# Altium schematic sheet Armor_Plate_V2.1.SchDoc
size A2
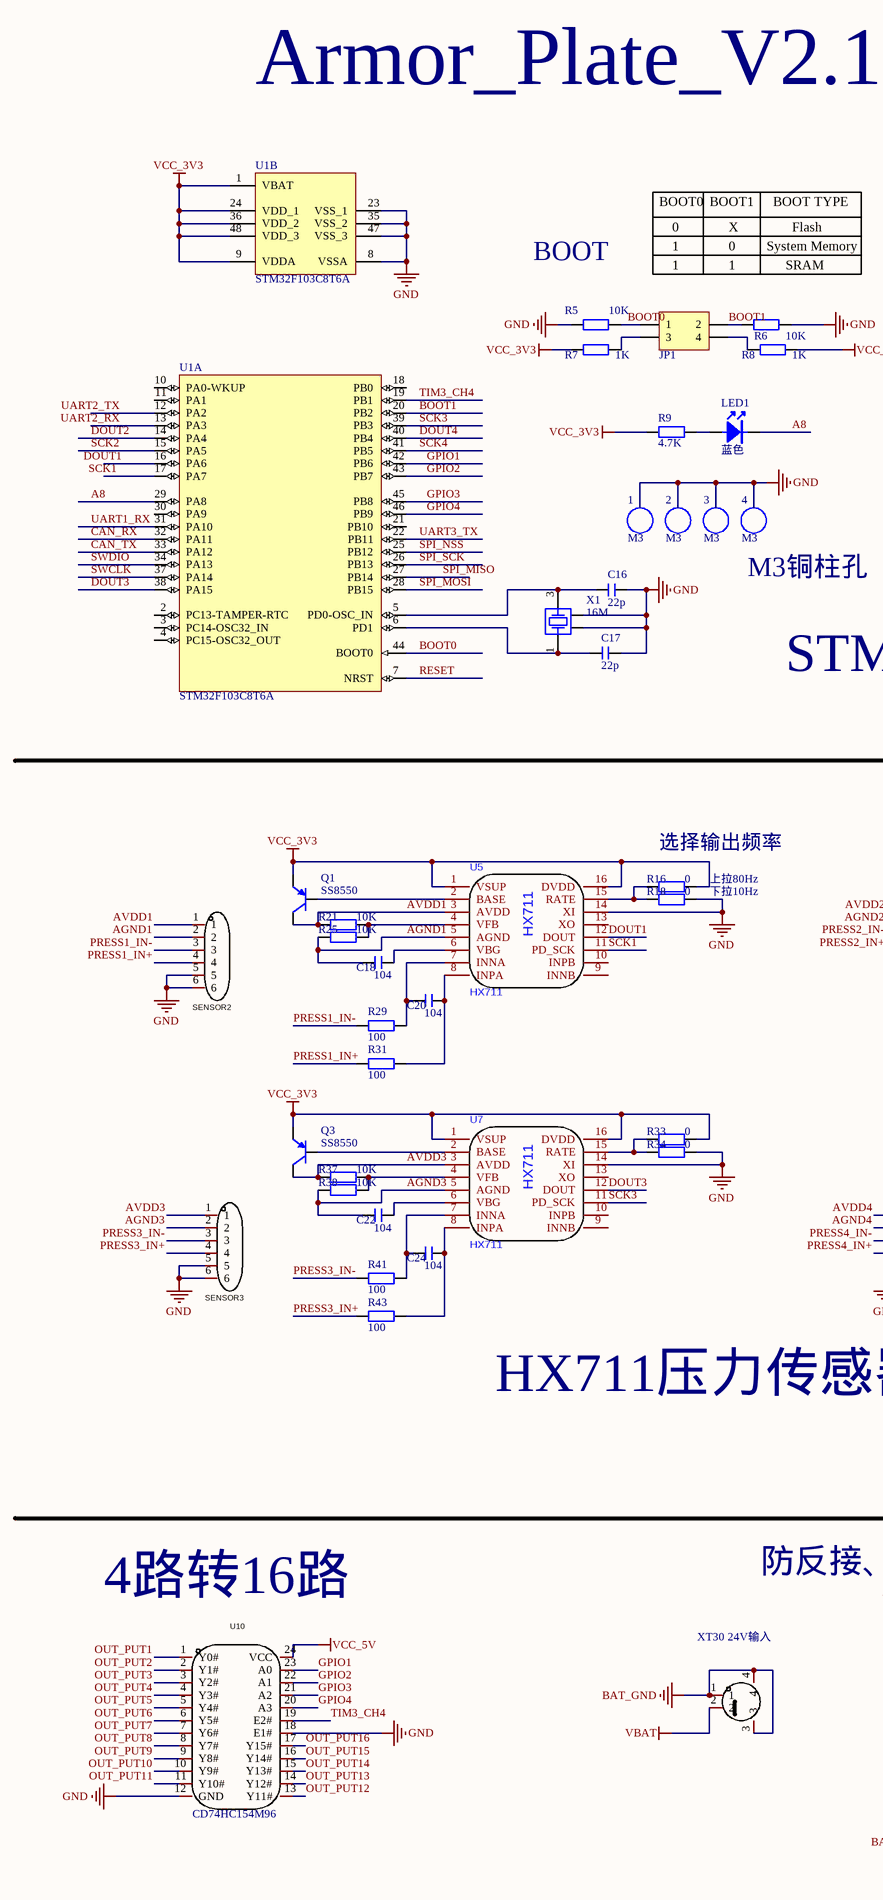
[diagram p0: Armor_Plate_V2.1.SchDoc, left]
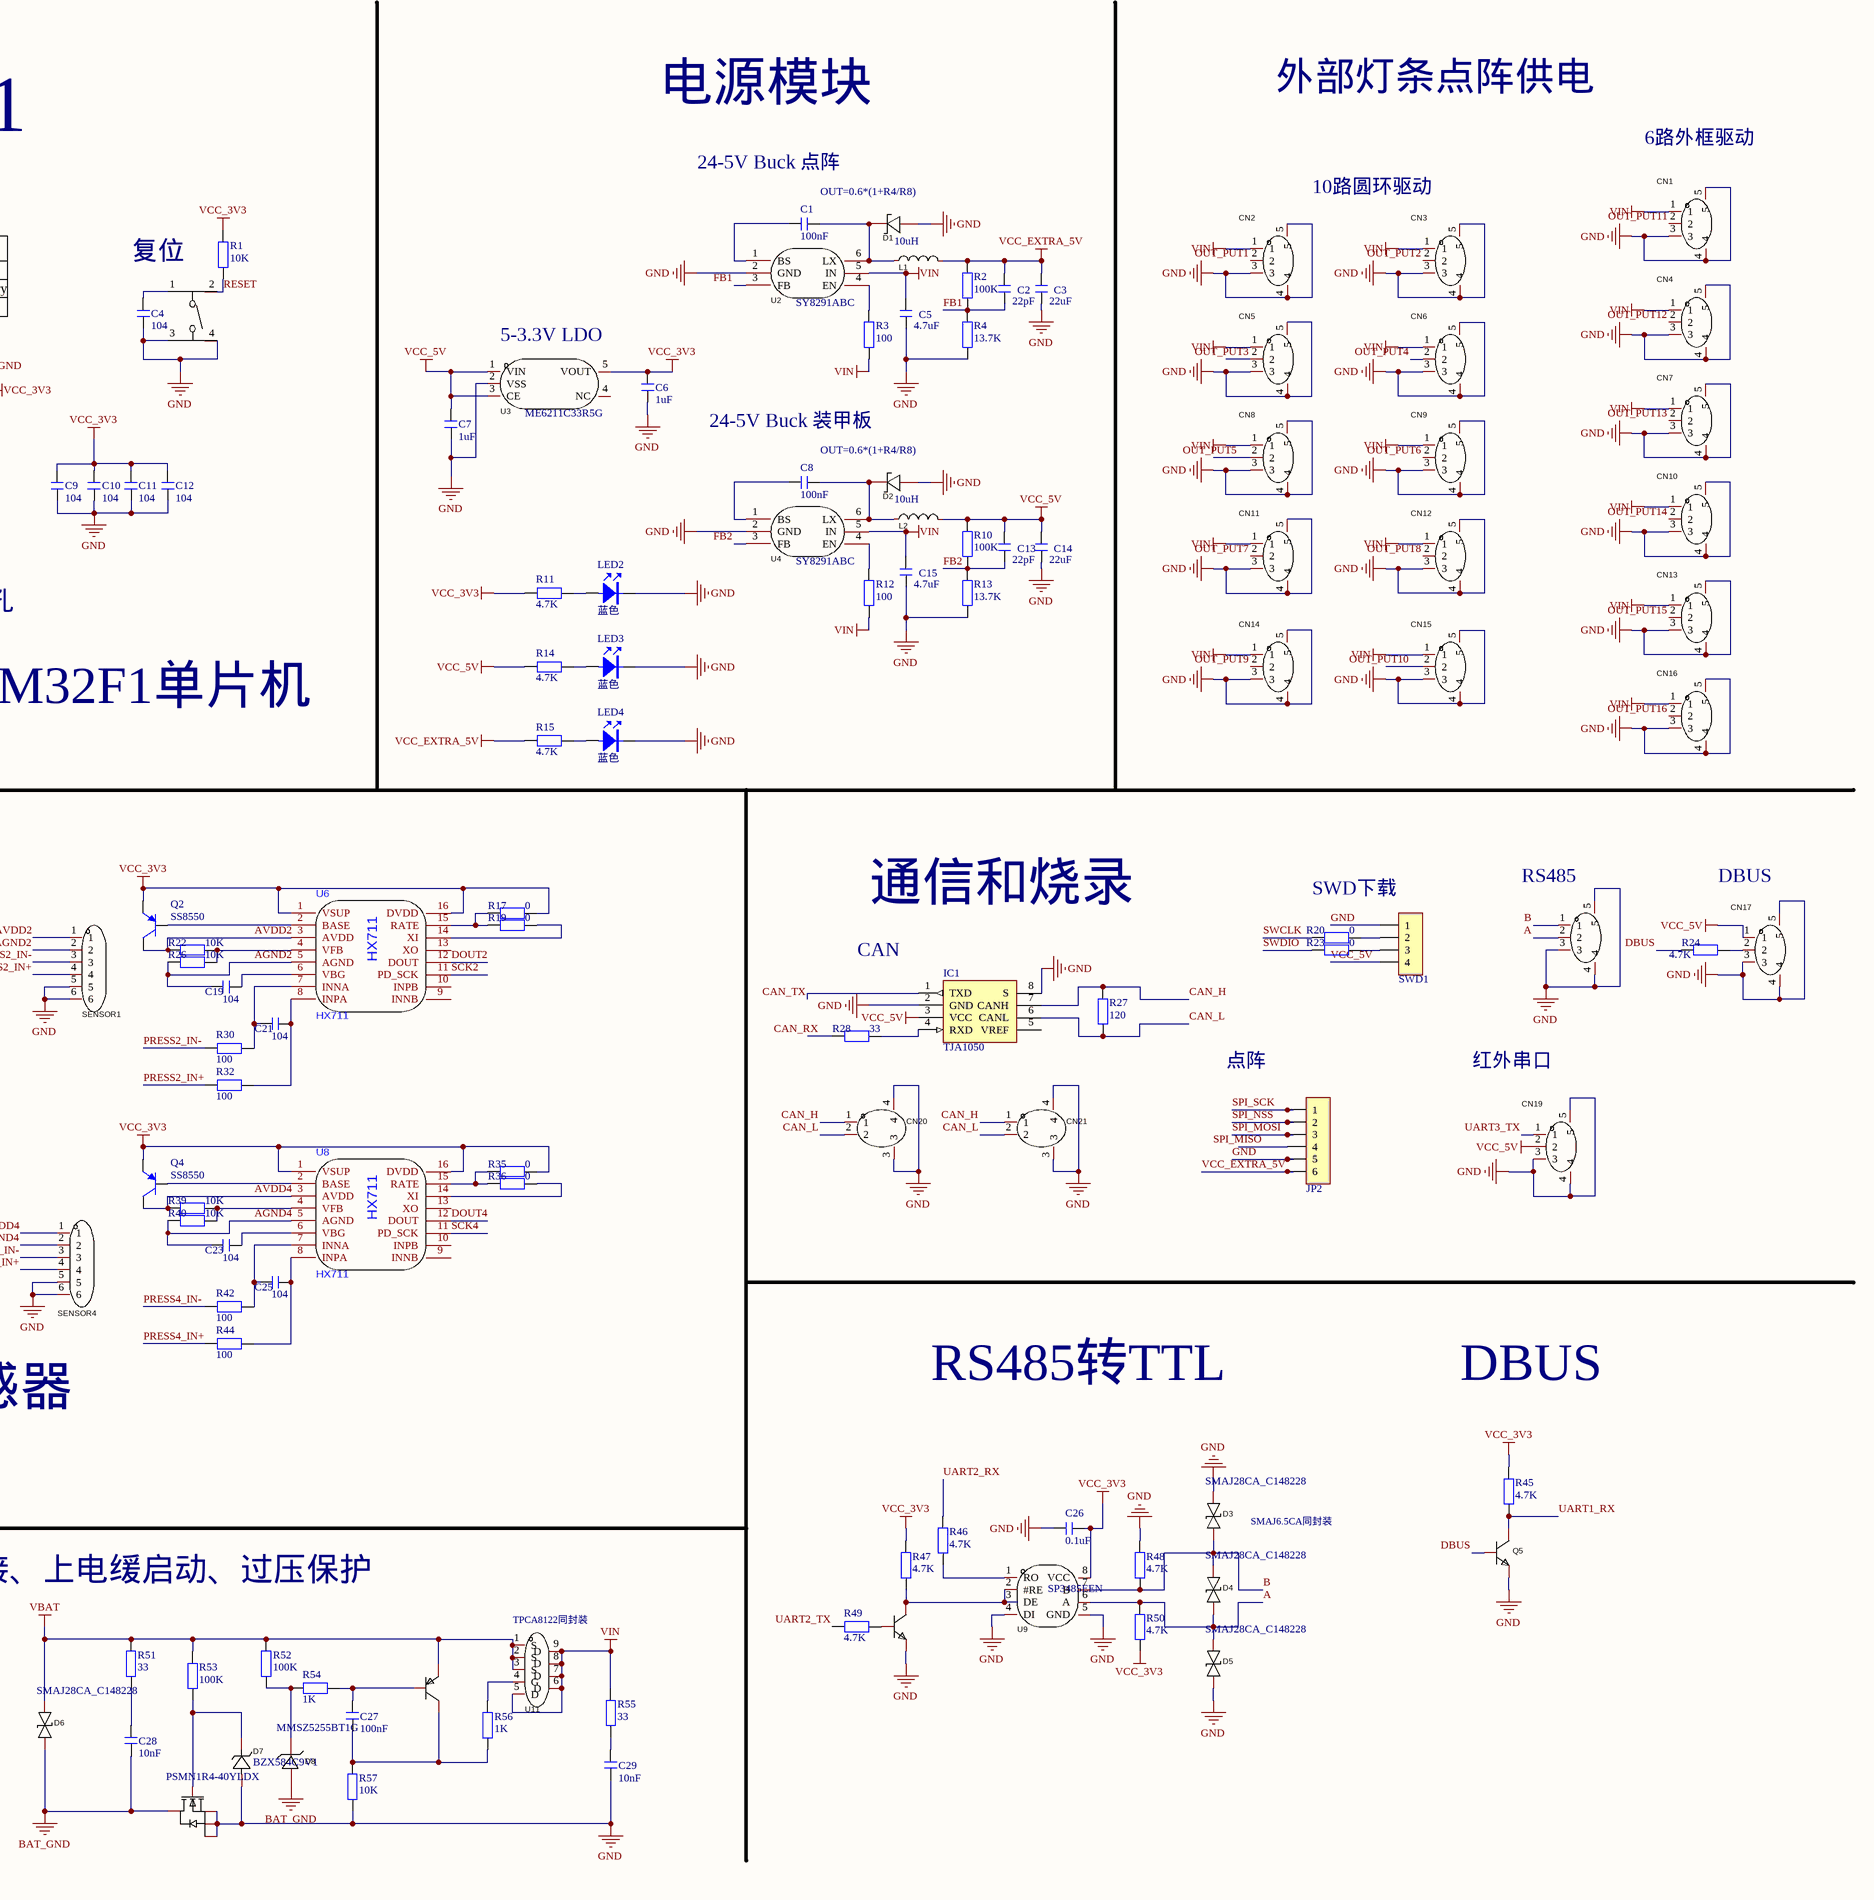
[diagram p1: Armor_Plate_V2.1.SchDoc, right]

## Parts
1  M3  [M3 125X200]
2  M3  [M3 125X200]
3  M3  [M3 125X200]
4  M3  [M3 125X200]
C1  100nF  [C 0603_L]
C2  22pF  [C 0603_L]
C3  22uF  [C 0603_L]
C4  104  [C 0603_L]
C5  4.7uF  [C 0603_L]
C6  1uF  [C 0603_L]
C7  1uF  [C 0603_L]
C8  100nF  [C 0603_L]
C9  104  [C 0603_L]
C10  104  [C 0603_L]
C11  104  [C 0603_L]
C12  104  [C 0603_L]
C13  22pF  [C 0603_L]
C14  22uF  [C 0603_L]
C15  4.7uF  [C 0603_L]
C16  22p  [C 0603_L]
C17  22p  [C 0603_L]
C18  104  [C 0603_L]
C19  104  [C 0603_L]
C20  104  [C 0603_L]
C21  104  [C 0603_L]
C22  104  [C 0603_L]
C23  104  [C 0603_L]
C24  104  [C 0603_L]
C25  104  [C 0603_L]
C26  0.1uF  [C 0603_L]
C27  100nF  [C 0603_L]
C28  10nF  [C 0603_L]
C29  10nF  [C 0603_L]
CN1  HX25003-3AWB  [CONN-SMD_3P-P2.50_HX25003-3AWB]  (value not drawn)
CN2  HX25003-3AWB  [CONN-SMD_3P-P2.50_HX25003-3AWB]  (value not drawn)
CN3  HX25003-3AWB  [CONN-SMD_3P-P2.50_HX25003-3AWB]  (value not drawn)
CN4  HX25003-3AWB  [CONN-SMD_3P-P2.50_HX25003-3AWB]  (value not drawn)
CN5  HX25003-3AWB  [CONN-SMD_3P-P2.50_HX25003-3AWB]  (value not drawn)
CN6  HX25003-3AWB  [CONN-SMD_3P-P2.50_HX25003-3AWB]  (value not drawn)
CN7  HX25003-3AWB  [CONN-SMD_3P-P2.50_HX25003-3AWB]  (value not drawn)
CN8  HX25003-3AWB  [CONN-SMD_3P-P2.50_HX25003-3AWB]  (value not drawn)
CN9  HX25003-3AWB  [CONN-SMD_3P-P2.50_HX25003-3AWB]  (value not drawn)
CN10  HX25003-3AWB  [CONN-SMD_3P-P2.50_HX25003-3AWB]  (value not drawn)
CN11  HX25003-3AWB  [CONN-SMD_3P-P2.50_HX25003-3AWB]  (value not drawn)
CN12  HX25003-3AWB  [CONN-SMD_3P-P2.50_HX25003-3AWB]  (value not drawn)
CN13  HX25003-3AWB  [CONN-SMD_3P-P2.50_HX25003-3AWB]  (value not drawn)
CN14  HX25003-3AWB  [CONN-SMD_3P-P2.50_HX25003-3AWB]  (value not drawn)
CN15  HX25003-3AWB  [CONN-SMD_3P-P2.50_HX25003-3AWB]  (value not drawn)
CN16  HX25003-3AWB  [CONN-SMD_3P-P2.50_HX25003-3AWB]  (value not drawn)
CN17  HX25003-3AWB  [CONN-SMD_3P-P2.50_HX25003-3AWB]  (value not drawn)
CN18  HX25003-3AWB  [CONN-SMD_3P-P2.50_HX25003-3AWB]  (value not drawn)
CN19  HX25003-3AWB  [CONN-SMD_3P-P2.50_HX25003-3AWB]  (value not drawn)
CN20  A1257WR-S-2P  [CONN-SMD_A1257WR-S-2P]  (value not drawn)
CN21  A1257WR-S-2P  [CONN-SMD_A1257WR-S-2P]  (value not drawn)
CN22  XT30PW-M  [CONN-TH_XT30PW-M]  (value not drawn)
D1  1N5819WS_C191023  [SOD-323_L1.8-W1.3-LS2.5-RD]  (value not drawn)
D2  1N5819WS_C191023  [SOD-323_L1.8-W1.3-LS2.5-RD]  (value not drawn)
D3  SMAJ28CA_C148228  [SMA_L4.4-W2.6-LS5.0-BI]
D4  SMAJ28CA_C148228  [SMA_L4.4-W2.6-LS5.0-BI]
D5  SMAJ28CA_C148228  [SMA_L4.4-W2.6-LS5.0-BI]
D6  SMAJ28CA_C148228  [SMA_L4.4-W2.6-LS5.0-BI]
D7  BZX584C9V1  [ESC_L1.2-W0.8-LS1.6-RD]
D8  MMSZ5255BT1G  [SOD-123_L2.7-W1.6-LS3.7-RD]
IC1  TJA1050  [SOP8_N]
JP1  Header2X2  [HDR2.54-LI-2x2P]  (value not drawn)
JP2  HDR-1X6  [MX 1.25-WS-6P]  (value not drawn)
L1  10uH  [IND-SMD_L11.2-W10.0]
L2  10uH  [IND-SMD_L11.2-W10.0]
LED1  蓝色  [LED 0805B]
LED2  蓝色  [LED 0805B]
LED3  蓝色  [LED 0805B]
LED4  蓝色  [LED 0805B]
Q1  SS8550  [SOT23-3N]
Q2  SS8550  [SOT23-3N]
Q3  SS8550  [SOT23-3N]
Q4  SS8550  [SOT23-3N]
Q5  S8050_C5249674  [SOT-23-3_L2.9-W1.6-P1.90-LS2.8-BR]  (value not drawn)
Q6  S8050_C5249674  [SOT-23-3_L2.9-W1.6-P1.90-LS2.8-BR]  (value not drawn)
Q7  S8550_C545533  [SOT-23-3_L2.9-W1.6-P1.90-LS2.8-BR]  (value not drawn)
Q8  PSMN1R4-40YLDX  [SOT-669_L4.9-W4.0-P1.27-LS6.0-BR]
R1  10K  [R 0603_L]
R2  100K  [R 0603_L]
R3  100  [R 0603_L]
R4  13.7K  [R 0603_L]
R5  10K  [R 0603_L]
R6  10K  [R 0603_L]
R7  1K  [R 0603_L]
R8  1K  [R 0603_L]
R9  4.7K  [R 0603_L]
R10  100K  [R 0603_L]
R11  4.7K  [R 0603_L]
R12  100  [R 0603_L]
R13  13.7K  [R 0603_L]
R14  4.7K  [R 0603_L]
R15  4.7K  [R 0603_L]
R16  0  [R 0603_L]
R17  0  [R 0603_L]
R18  0  [R 0603_L]
R19  0  [R 0603_L]
R20  0  [R 0603_L]
R21  10K  [R 0603_L]
R22  10K  [R 0603_L]
R23  0  [R 0603_L]
R24  4.7K  [R 0603_L]
R25  10K  [R 0603_L]
R26  10K  [R 0603_L]
R27  120  [R 0603_L]
R28  33  [R 0603_L]
R29  100  [R 0603_L]
R30  100  [R 0603_L]
R31  100  [R 0603_L]
R32  100  [R 0603_L]
R33  0  [R 0603_L]
R34  0  [R 0603_L]
R35  0  [R 0603_L]
R36  0  [R 0603_L]
R37  10K  [R 0603_L]
R38  10K  [R 0603_L]
R39  10K  [R 0603_L]
R40  10K  [R 0603_L]
R41  100  [R 0603_L]
R42  100  [R 0603_L]
R43  100  [R 0603_L]
R44  100  [R 0603_L]
R45  4.7K  [R 0603_L]
R46  4.7K  [R 0603_L]
R47  4.7K  [R 0603_L]
R48  4.7K  [R 0603_L]
R49  4.7K  [R 0603_L]
R50  4.7K  [R 0603_L]
R51  33  [R 0603_L]
R52  100K  [R 0603_L]
R53  100K  [R 0603_L]
R54  1K  [R 0603_L]
R55  33  [R 0603_L]
R56  1K  [R 0603_L]
R57  10K  [R 0603_L]
SENSOR1  GH125-S04DCA-00  [CONN-SMD_4P-P1.27_GH125-S04DCA-00]  (value not drawn)
SENSOR2  GH125-S04DCA-00  [CONN-SMD_4P-P1.27_GH125-S04DCA-00]  (value not drawn)
SENSOR3  GH125-S04DCA-00  [CONN-SMD_4P-P1.27_GH125-S04DCA-00]  (value not drawn)
SENSOR4  GH125-S04DCA-00  [CONN-SMD_4P-P1.27_GH125-S04DCA-00]  (value not drawn)
SW1  ST-1188  [SW-SMD_4P-L4.2-W3.2-P2.15-LS5.2]  (value not drawn)
SWD1  HDR-1X4  [MX 1.25-WS-4P]  (value not drawn)
U1  STM32F103C8T6A  [LQFP48 7X7_N]  (parts A,B of 2)
U2  SY8291ABC  [SOT-23-6_L2.9-W1.6-P0.95-LS2.8-BR]
U3  ME6211C33R5G  [SOT-23-5_L3.0-W1.7-P0.95-LS2.8-BR]
U4  SY8291ABC  [SOT-23-6_L2.9-W1.6-P0.95-LS2.8-BR]
U5  HX711  [SOP-16_L10.0-W3.9-P1.27-LS6.0-BL]
U6  HX711  [SOP-16_L10.0-W3.9-P1.27-LS6.0-BL]
U7  HX711  [SOP-16_L10.0-W3.9-P1.27-LS6.0-BL]
U8  HX711  [SOP-16_L10.0-W3.9-P1.27-LS6.0-BL]
U9  SP3485EEN  [SOP-8_L5.0-W4.0-P1.27-LS6.0-BL]
U10  CD74HC154M96  [SOIC-24_L15.4-W7.5-P1.27-LS10.3-BL]
U11  TPCA8122  [DFN-8_L5.8-W4.9-P1.27-LS6.0-BL-1]  (value not drawn)
X1  16M  [OSC 3225-4P]

## Nets
BAT_GND: C28.2 CN22.1 CN22.3 CN22.4 D6.1 D8.2(A) Q8.5(D)
GND: C3.1 C4.1 C5.1 C6.1 C7.1 C9.1 C10.1 C11.1 C12.1 C14.1 C15.1 C16.2 C17.2 C26.1 C29.2 CN1.3 CN1.4 CN1.5 CN2.3 CN2.4 CN2.5 CN3.3 CN3.4 CN3.5 CN4.3 CN4.4 CN4.5 CN5.3 CN5.4 CN5.5 CN6.3 CN6.4 CN6.5 CN7.3 CN7.4 CN7.5 CN8.3 CN8.4 CN8.5 CN9.3 CN9.4 CN9.5 CN10.3 CN10.4 CN10.5 CN11.3 CN11.4 CN11.5 CN12.3 CN12.4 CN12.5 CN13.3 CN13.4 CN13.5 CN14.3 CN14.4 CN14.5 CN15.3 CN15.4 CN15.5 CN16.3 CN16.4 CN16.5 CN17.3 CN17.4 CN17.5 CN18.3 CN18.4 CN18.5 CN19.3 CN19.4 CN19.5 CN20.3 CN20.4 CN21.3 CN21.4 D1.2(A) D2.2(A) D3.2 D5.1 D7.2(A) IC1.2(GND) IC1.8(S) JP2.5 LED2.2(K) LED3.2(K) LED4.2(K) Q5.2(E) Q6.2(E) Q8.1(S) Q8.2(S) Q8.3(S) R4.1 R5.1 R6.2 R13.1 R18.2 R34.2 R48.2 R57.2 SENSOR1.5 SENSOR1.6 SENSOR2.5 SENSOR2.6 SENSOR3.5 SENSOR3.6 SENSOR4.5 SENSOR4.6 SW1.3 SW1.4 SWD1.1 U1.8(VSSA) U1.23(VSS_1) U1.35(VSS_2) U1.47(VSS_3) U2.2(GND) U3.2(VSS) U4.2(GND) U5.14(XI) U7.14(XI) U9.4(DI) U9.5(GND) U10.12(GND) U10.18(E1#) X1.2 X1.4
VBAT: CN22.2 D6.2 Q7.2(E) R51.2 R52.2 R53.2 U11.1(S) U11.2(S) U11.3(S)
VCC_3V3: C6.2 C9.2 C10.2 C11.2 C12.2 C26.2 Q1.2(E) Q2.2(E) Q3.2(E) Q4.2(E) R1.2 R7.1 R8.2 R9.1 R11.1 R16.2 R17.2 R33.2 R35.2 R45.2 R47.2 R50.1 U1.1(VBAT) U1.9(VDDA) U1.24(VDD_1) U1.36(VDD_2) U1.48(VDD_3) U3.5(VOUT) U5.1(VSUP) U5.16(DVDD) U6.1(VSUP) U6.16(DVDD) U7.1(VSUP) U7.16(DVDD) U8.1(VSUP) U8.16(DVDD) U9.8(VCC)
VCC_5V: C7.2 C13.2 C14.2 CN17.1 CN19.2 IC1.3(VCC) L2.2 R10.2 R14.1 SWD1.4 U3.1(VIN) U3.3(CE) U10.24(VCC)
VCC_EXTRA_5V: C2.2 C3.2 JP2.6 L1.2 R2.2 R15.1
VIN: C5.2 C15.2 CN1.1 CN2.1 CN3.1 CN4.1 CN5.1 CN6.1 CN7.1 CN8.1 CN9.1 CN10.1 CN11.1 CN12.1 CN13.1 CN14.1 CN15.1 CN16.1 R3.1 R12.1 R55.1 U2.5(IN) U4.5(IN) U11.5(D) U11.6(D) U11.7(D) U11.8(D) U11.9(D)
A: CN18.2 D4.1 D5.2 R50.2 U9.6(A)
A8: LED1.2(K) U1.29(PA8)
AGND1: C18.2 R25.1 SENSOR2.2 U5.5(AGND)
AGND2: C19.2 R26.1 SENSOR1.2 U6.5(AGND)
AGND3: C22.2 R38.1 SENSOR3.2 U7.5(AGND)
AGND4: C23.2 R40.1 SENSOR4.2 U8.5(AGND)
AVDD1: Q1.3(C) R21.1 SENSOR2.1 U5.3(AVDD)
AVDD2: Q2.3(C) R22.1 SENSOR1.1 U6.3(AVDD)
AVDD3: Q3.3(C) R37.1 SENSOR3.1 U7.3(AVDD)
AVDD4: Q4.3(C) R39.1 SENSOR4.1 U8.3(AVDD)
B: CN18.1 D3.1 D4.2 R48.1 U9.7(B)
BOOT0: JP1.1 R5.2 U1.44(BOOT0)
BOOT1: JP1.2 R6.1 U1.20(PB2)
CAN_H: CN20.1 CN21.1 IC1.7(CANH) R27.2
CAN_L: CN20.2 CN21.2 IC1.6(CANL) R27.1
CAN_RX: R28.1 U1.32(PA11)
CAN_TX: IC1.1(TXD) U1.33(PA12)
DBUS: Q5.1(B) R24.1
DOUT1: U1.16(PA6) U5.12(DOUT)
DOUT2: U1.14(PA4) U6.12(DOUT)
DOUT3: U1.38(PA15) U7.12(DOUT)
DOUT4: U1.40(PB4) U8.12(DOUT)
FB1: C2.1 R2.1 R4.2 U2.3(FB)
FB2: C13.1 R10.1 R13.2 U4.3(FB)
GPIO1: U1.42(PB6) U10.23(A0)
GPIO2: U1.43(PB7) U10.22(A1)
GPIO3: U1.45(PB8) U10.21(A2)
GPIO4: U1.46(PB9) U10.20(A3)
OUT_PUT1: CN2.2 U10.1(Y0#)
OUT_PUT2: CN3.2 U10.2(Y1#)
OUT_PUT3: CN5.2 U10.3(Y2#)
OUT_PUT4: CN6.2 U10.4(Y3#)
OUT_PUT5: CN8.2 U10.5(Y4#)
OUT_PUT6: CN9.2 U10.6(Y5#)
OUT_PUT7: CN11.2 U10.7(Y6#)
OUT_PUT8: CN12.2 U10.8(Y7#)
OUT_PUT9: CN14.2 U10.9(Y8#)
OUT_PUT10: CN15.2 U10.10(Y9#)
OUT_PUT11: CN1.2 U10.11(Y10#)
OUT_PUT12: CN4.2 U10.13(Y11#)
OUT_PUT13: CN7.2 U10.14(Y12#)
OUT_PUT14: CN10.2 U10.15(Y13#)
OUT_PUT15: CN13.2 U10.16(Y14#)
OUT_PUT16: CN16.2 U10.17(Y15#)
PRESS1_IN+: R31.2 SENSOR2.4
PRESS1_IN-: R29.1 SENSOR2.3
PRESS2_IN+: R32.2 SENSOR1.4
PRESS2_IN-: R30.1 SENSOR1.3
PRESS3_IN+: R43.2 SENSOR3.4
PRESS3_IN-: R41.1 SENSOR3.3
PRESS4_IN+: R44.2 SENSOR4.4
PRESS4_IN-: R42.1 SENSOR4.3
RESET: R1.1 SW1.2 U1.7(NRST)
SCK1: U1.17(PA7) U5.11(PD_SCK)
SCK2: U1.15(PA5) U6.11(PD_SCK)
SCK3: U1.39(PB3) U7.11(PD_SCK)
SCK4: U1.41(PB5) U8.11(PD_SCK)
SPI_MISO: JP2.4 U1.27(PB14)
SPI_MOSI: JP2.3 U1.28(PB15)
SPI_NSS: JP2.2 U1.25(PB12)
SPI_SCK: JP2.1 U1.26(PB13)
SWCLK: R20.1 U1.37(PA14)
SWDIO: R23.1 U1.34(PA13)
TIM3_CH4: U1.19(PB1) U10.19(E2#)
UART1_RX: Q5.3(C) R45.1 U1.31(PA10)
UART2_RX: R46.2 U1.13(PA3)
UART2_TX: R49.1 U1.12(PA2)
UART3_TX: CN19.1 U1.22(PB11)
NetC1_1: C1.1 D1.1(C) L1.1 U2.6(LX)
NetC1_2: C1.2 U2.1(BS)
NetC4_2: C4.2 SW1.1
NetC8_1: C8.1 D2.1(C) L2.1 U4.6(LX)
NetC8_2: C8.2 U4.1(BS)
NetC16_1: C16.1 U1.5(PD0-OSC_IN) X1.3
NetC17_1: C17.1 U1.6(PD1) X1.1
NetC18_1: C18.1 U5.6(VBG)
NetC19_1: C19.1 U6.6(VBG)
NetC20_1: C20.1 R31.1 U5.8(INPA)
NetC20_2: C20.2 R29.2 U5.7(INNA)
NetC21_1: C21.1 R32.1 U6.8(INPA)
NetC21_2: C21.2 R30.2 U6.7(INNA)
NetC22_1: C22.1 U7.6(VBG)
NetC23_1: C23.1 U8.6(VBG)
NetC24_1: C24.1 R43.1 U7.8(INPA)
NetC24_2: C24.2 R41.2 U7.7(INNA)
NetC25_1: C25.1 R44.1 U8.8(INPA)
NetC25_2: C25.2 R42.2 U8.7(INNA)
NetC27_1: C27.1 Q7.1(B) R54.1
NetC27_2: C27.2 Q7.3(C) R56.2 R57.1
NetC28_1: C28.1 R51.1
NetC29_1: C29.1 R55.2
NetCN17_2: CN17.2 R24.2
NetD7_1: D7.1(K) Q8.4(G) R53.1
NetD8_1: D8.1(K) R52.1 R54.2
NetIC1_4: IC1.4(RXD) R28.2
NetJP1_3: JP1.3 R7.2
NetJP1_4: JP1.4 R8.1
NetLED1_1: LED1.1(A) R9.2
NetLED2_1: LED2.1(A) R11.2
NetLED3_1: LED3.1(A) R14.2
NetLED4_1: LED4.1(A) R15.2
NetQ1_1: Q1.1(B) U5.2(BASE)
NetQ2_1: Q2.1(B) U6.2(BASE)
NetQ3_1: Q3.1(B) U7.2(BASE)
NetQ4_1: Q4.1(B) U8.2(BASE)
NetQ6_1: Q6.1(B) R49.2
NetQ6_3: Q6.3(C) R47.1 U9.2(#RE) U9.3(DE)
NetR3_2: R3.2 U2.4(EN)
NetR12_2: R12.2 U4.4(EN)
NetR16_1: R16.1 R18.1 U5.15(RATE)
NetR17_1: R17.1 R19.1 U6.15(RATE)
NetR19_2: R19.2 U6.14(XI)
NetR20_2: R20.2 SWD1.2
NetR21_2: R21.2 R25.2 U5.4(VFB)
NetR22_2: R22.2 R26.2 U6.4(VFB)
NetR23_2: R23.2 SWD1.3
NetR33_1: R33.1 R34.1 U7.15(RATE)
NetR35_1: R35.1 R36.1 U8.15(RATE)
NetR36_2: R36.2 U8.14(XI)
NetR37_2: R37.2 R38.2 U7.4(VFB)
NetR39_2: R39.2 R40.2 U8.4(VFB)
NetR46_1: R46.1 U9.1(RO)
NetR56_1: R56.1 U11.4(G)

Not connected (* = marked no-connect by the designer): IC1 5(VREF); U1 2(PC13-TAMPER-RTC) 3(PC14-OSC32_IN) 4(PC15-OSC32_OUT) 10(PA0-WKUP) 11(PA1) 18(PB0) 21(PB10) 30(PA9); U3 4(NC); U5 9(INNB) 10(INPB) 13(XO); U6 9(INNB) 10(INPB) 13(XO); U7 9(INNB) 10(INPB) 13(XO); U8 9(INNB) 10(INPB) 13(XO)

## Notes on the sheet
- 电源模块
- 外部灯条点阵供电
- Armor_Plate_V2.1
- 24-5V Buck 点阵
- OUT=0.6*(1+R4/R8)
- 10路圆环驱动
- 6路外框驱动
- BOOT0
- BOOT1
- BOOT TYPE
- BOOT
- 1
- 0
- X
- System Memory
- SRAM
- Flash
- 复位
- (near U3) 5-3.3V LDO
- 24-5V Buck 装甲板
- (near 4) M3铜柱孔
- STM32F1单片机
- 选择输出频率
- 上拉80Hz
- 下拉10Hz
- 通信和烧录
- SWD下载
- (near CN18) RS485
- (near CN17) DBUS
- CAN
- 点阵
- 红外串口
- HX711压力传感器
- RS485转TTL
- DBUS
- (near D3) SMAJ6.5CA同封装
- 4路转16路
- 防反接、上电缓启动、过压保护
- (near CN22) XT30 24V输入
- (near U11) TPCA8122同封装

## Library data of the parts
1-4 = M3: 铜柱孔; 淘宝ID: 小糖豆的小窝窝; BOM名称: 铜柱孔; 下单链接: https://item.taobao.com/item.htm?ft=t&id=613637044352
C1-C29 = C: 贴片电容; 淘宝ID: 小糖豆的小窝窝; BOM名称: 贴片电容; 下单链接: https://item.taobao.com/item.htm?ft=t&id=613637044352
CN1-CN19 = HX25003-3AWB: Manufacturer: HX(红星); Add into BOM: yes; Reference Series: XH; Pitch: 2.5mm; Pins Structure: 1x3P; Number of PINs Per Row: 3; Gender: 公型插针; Name: HX25003-3AWB; Symbol: HX25003-3AWB; Device: HX25003-3AWB; LCSC Part Name: 母座 卧贴 2.5mm 3Pin位; Supplier Part: C442362; Manufacturer Part: HX25003-3AWB; Supplier Footprint: SMD,P=2.5mm; JLCPCB Part Class: Extended Part; Datasheet: https://atta.szlcsc.com/upload/public/pdf/source/20191028/C442362_2DF0B127B8A5618AF5B5FF34AA4ACD81.pdf; Supplier: LCSC; Convert to PCB: yes; Number of Rows: 1; Row Spacing: -; Mounting Style: 卧贴; Current Rating (Max): -; Operating Temperature Range: -
CN20 CN21 = A1257WR-S-2P: Manufacturer: CJT(长江连接器); Add into BOM: yes; Reference Series: GH; Pitch: 1.25mm; Pins Structure: 1x2P; Number of PINs Per Row: 2; Name: A1257WR-S-2P; Symbol: A1257WR-S-2P; Device: A1257WR-S-2P; LCSC Part Name: GH1.25卧式贴片 镀锡 2P 针座连接器; Supplier Part: C225125; Manufacturer Part: A1257WR-S-2P; Supplier Footprint: SMD,P=1.25mm; JLCPCB Part Class: Extended Part; Datasheet: https://atta.szlcsc.com/upload/public/pdf/source/20180509/C225125_BADC516D96738E603F25032F5968DE8B.pdf; Supplier: LCSC; Convert to PCB: yes; Number of Rows: 1; Row Spacing: -; Mounting Style: -; Contact Material: 黄铜
CN22 = XT30PW-M: Manufacturer: AMASS(艾迈斯); Add into BOM: yes; Name: XT30PW-M; Symbol: XT30PW-M; Device: XT30PW-M; LCSC Part Name: XT30PW-M公头; Supplier Part: C431092; Manufacturer Part: XT30PW-M; Supplier Footprint: Through Hole; JLCPCB Part Class: Extended Part; Datasheet: https://atta.szlcsc.com/upload/public/pdf/source/20220222/6A9F22F7850E25B33E1BE430ADF8560B.pdf; Supplier: LCSC; Convert to PCB: yes
D1 D2 = 1N5819WS_C191023: Manufacturer: Hottech(合科泰); Add into BOM: yes; Reverse Voltage (Vr): 40V; Average Rectified Current (Io): 1A; Forward Voltage (Vf@If): 600mV@1A; Name: 1N5819WS; Symbol: 1N5819WS; Device: 1N5819WS_C191023; LCSC Part Name: 40V 1A 600mV@1A; Supplier Part: C191023; Manufacturer Part: 1N5819WS; Supplier Footprint: SOD-323; JLCPCB Part Class: Basic Part; Datasheet: https://atta.szlcsc.com/upload/public/pdf/source/20180614/C191023_3C6A6398B911F3A4C23E7538EE054643.pdf; Supplier: LCSC; Convert to PCB: yes
D3-D6 = SMAJ28CA_C148228: Manufacturer: Littelfuse(美国力特); Symbol: SMAJ28CA-C148228; Add into BOM: yes; Polarity: 双向; Reverse Stand-Off Voltage (Vrwm): 28V; Breakdown Voltage: 31.1V; Peak Pulse Current (Ipp)@10/1000μs: 8.8A; Maximum Clamping Voltage: 45.4V; Name: SMAJ28CA; Device: SMAJ28CA_C148228; LCSC Part Name: 双向 Vrwm:28V; Supplier Part: C148228; Manufacturer Part: SMAJ28CA; Supplier Footprint: SMA(DO-214AC); JLCPCB Part Class: Extended Part; Datasheet: https://atta.szlcsc.com/upload/public/pdf/source/20171120/C148228_15111593374921130506.pdf; Supplier: LCSC; Convert to PCB: yes
D7 = BZX584C9V1: Manufacturer: YANGJIE(扬杰); Add into BOM: yes; Diode Configuration: 独立式; Zener Voltage (Nom): 9.1V; Zener Voltage (Range): 8.5V~9.6V; Power Dissipation: 200mW; Reverse Leakage Current (Ir): 200nA@7V; Zener Impedance (Zzt): 15Ω; Name: BZX584C9V1; Symbol: BZX584C9V1; Device: BZX584C9V1; LCSC Part Name: 9.1V 200mW; Supplier Part: C968211; Manufacturer Part: BZX584C9V1; Supplier Footprint: SOD-523; JLCPCB Part Class: Extended Part; Datasheet: https://atta.szlcsc.com/upload/public/pdf/source/20201222/C968180_8DEF4A0FE776E72B62938E062B6263B6.pdf; Supplier: LCSC; Convert to PCB: yes; Tolerance: -
D8 = MMSZ5255BT1G: Manufacturer: onsemi(安森美); Add into BOM: yes; Diode Configuration: 独立式; Zener Voltage (Nom): 28V; Zener Voltage (Range): 26.6V~29.4V; Tolerance: ±5%; Power Dissipation: 500mW; Reverse Leakage Current (Ir): 100nA@21V; Zener Impedance (Zzt): 44Ω; Name: MMSZ5255BT1G; Symbol: MMSZ5255BT1G; Device: MMSZ5255BT1G; LCSC Part Name: 齐纳二极管 500 mW SOD-123; Supplier Part: C242284; Manufacturer Part: MMSZ5255BT1G; Supplier Footprint: SOD-123; JLCPCB Part Class: Extended Part; Datasheet: https://atta.szlcsc.com/upload/public/pdf/source/20221020/24E30AC3B161AD81AE78606E4A7F6AC2.pdf; Supplier: LCSC; Convert to PCB: yes
IC1 = TJA1050: CAN总线收发芯片; 淘宝ID: 小糖豆的小窝窝; BOM名称: CAN总线收发芯片; Alias1: https://item.taobao.com/item.htm?ft=t&id=613637044352
JP1 = Header 2X2: 2*2P接插件; 淘宝ID: 小糖豆的小窝窝; BOM名称: 2*2P接插件; 下单链接: https://item.taobao.com/item.htm?ft=t&id=613637044352
JP2 = Header 6: 6P接插件; 淘宝ID: 小糖豆的小窝窝; BOM名称: 6P接插件; 下单链接: https://item.taobao.com/item.htm?ft=t&id=613637044352
L1 L2 = MCS10406R8MPY1: Manufacturer: PSA(信昌电陶); Name: 6.8uH; Symbol: MCS1040-6R8MPY1; Add into BOM: yes; Value: 6.8uH; Tolerance: ±20%; Rated Current: 6.5A; Saturation Current (Isat): 9A; DC Resistance (DCR): 22.5mΩ; Device: MCS10406R8MPY1; LCSC Part Name: 6.8uH ±20% 6.5A 22.5mΩ; Supplier Part: C2937098; Manufacturer Part: MCS10406R8MPY1; Supplier Footprint: 1040; JLCPCB Part Class: Extended Part; Datasheet: https://atta.szlcsc.com/upload/public/pdf/source/20220210/B4F70DB870B0F229EFB5194A845469A9.pdf; Supplier: LCSC; Convert to PCB: yes
LED1-LED4 = LED-SMD: 贴片LED; 淘宝ID: 小糖豆的小窝窝; BOM名称: 贴片LED; 下单链接: https://item.taobao.com/item.htm?ft=t&id=613637044352
Q1-Q4 = 8550-SMD: 高频放大-PNP型; 淘宝ID: 小糖豆的小窝窝; BOM名称: 高频放大-PNP型; 下单链接: https://item.taobao.com/item.htm?ft=t&id=613637044352
Q5 Q6 = S8050_C5249674: Manufacturer: ElecSuper(静芯微）; Name: S8050; Add into BOM: yes; Symbol: S8050_C5249674; Device: S8050_C5249674; LCSC Part Name: S8050; Supplier Part: C5249674; Manufacturer Part: S8050; Supplier Footprint: SOT-23; JLCPCB Part Class: Extended Part; Datasheet: https://atta.szlcsc.com/upload/public/pdf/source/20221109/F3F5EDE41344C501BF02B6CC0D78E6D8.pdf; Supplier: LCSC; Convert to PCB: yes
Q7 = S8550_C545533: Manufacturer: UMW(广东友台半导体); Name: S8550; Add into BOM: yes; Transistor Type: PNP; Collector-Emitter Breakdown Voltage (Vceo): 25V; Collector Current (Ic): 500mA; Power Dissipation (Pd): 300mW; Collector-Emitter Saturation Voltage (VCE(sat)@Ic,Ib): 600mV@500mA,50mA; Transition Frequency (fT): 150MHz; Symbol: S8550_C545533; Device: S8550_C545533; LCSC Part Name: S8550; Supplier Part: C545533; Manufacturer Part: S8550; Supplier Footprint: SOT-23-3; JLCPCB Part Class: Extended Part; Datasheet: https://atta.szlcsc.com/upload/public/pdf/source/20211011/8CBA04D874BE5A0FC10F979D18183A3A.pdf; Supplier: LCSC; Convert to PCB: yes; DC Current Gain (hFE@Ic,Vce): -; Operating Temperature: +150℃@(Tj)
Q8 = PSMN1R4-40YLDX: Manufacturer: Nexperia(安世); Add into BOM: yes; Type: N沟道; Drain Source Voltage (Vdss): 40V; Continuous Drain Current (Id): 100A; Power Dissipation (Pd): 238W; Drain Source On Resistance (RDS(on)@Vgs,Id): 1.4mΩ@10V,25A; Gate Threshold Voltage (Vgs(th)@Id): 2.2V@1mA; Name: PSMN1R4-40YLDX; Symbol: PSMN1R4-40YLDX; Device: PSMN1R4-40YLDX; LCSC Part Name: N沟道 40V 100A; Supplier Part: C458253; Manufacturer Part: PSMN1R4-40YLDX; Supplier Footprint: SOT669; JLCPCB Part Class: Extended Part; Datasheet: https://atta.szlcsc.com/upload/public/pdf/source/20191121/C458253_E2C9D3DA08B9360ECF3070255ECBA475.pdf; Supplier: LCSC; Convert to PCB: yes
R1-R57 = R: 贴片电阻; 淘宝ID: 小糖豆的小窝窝; BOM名称: 贴片电阻; 下单链接: https://item.taobao.com/item.htm?ft=t&id=613637044352
SENSOR1-SENSOR4 = GH125-S04DCA-00: Manufacturer: JS(钜硕电子); Add into BOM: yes; Pitch: 1.25mm; Pins Structure: 1x4P; Number of PINs Per Row: 4; Gender: 公型插针; Current Rating (Max): 1A; Name: GH125-S04DCA-00; Symbol: GH125-S04DCA-00; Device: GH125-S04DCA-00; LCSC Part Name: GH1.25卧式贴片 带扣; Supplier Part: C2886767; Manufacturer Part: GH125-S04DCA-00; Supplier Footprint: SMD,P=1.25mm; JLCPCB Part Class: Extended Part; Datasheet: https://atta.szlcsc.com/upload/public/pdf/source/20210818/CD11791E5ED3EDF45A7009E9C8A2BD4C.pdf; Supplier: LCSC; Convert to PCB: yes; Reference Series: -; Number of Rows: 1; Row Spacing: -; Mounting Style: 卧贴; Operating Temperature Range: -25℃~+85℃
SW1 = SW-SMD_4P-L4.2-W3.2-P2.15-LS5.2: Manufacturer: RISHENG(日昇); Add into BOM: yes; Contact Current: 50mA; Voltage Rating (DC): 12V; Insulation Resistance: 100MΩ; Circuit: 单刀单掷; Actuator Style: 椭圆形按钮; Actuator/Cap Color: 白色; Operating Force: 250gf@±50gf; Mechanical Life: 100000; Pin Style: SMD接片; Switch Length: 4.2mm; Switch Width: 3.4mm; Switch Height: 2.5mm; Strike Gundam: 否; Name: ST-1188; Symbol: ST-1188; Device: ST-1188; LCSC Part Name: 轻触开关四脚正按; Supplier Part: C589212; Manufacturer Part: ST-1188; Supplier Footprint: SMD; JLCPCB Part Class: Extended Part; Datasheet: https://atta.szlcsc.com/upload/public/pdf/source/20200922/C589212_9D19074D50EA2FDC5769A293FA310A99.pdf; Supplier: LCSC; Convert to PCB: yes; Mounting Style: 立贴; Operating Temperature: -20℃~+85℃
SWD1 = Header 4: 4P接插件; 淘宝ID: 小糖豆的小窝窝; BOM名称: 4P接插件; 下单链接: https://item.taobao.com/item.htm?ft=t&id=613637044352
U1 = STM32F103C8T6: STM32 ARM-based 32-bit MCU Performance Line with 64 kB Flash, 20 kB Internal RAM, -40 to +85癈 Temperature, 48-Pin LQFP, Tray; BOM名称: STM32F103C8T6A
U2 U4 = SY8291ABC: Manufacturer: silergy(矽力杰); Add into BOM: yes; Function: 降压型; Name: SY8291ABC; Symbol: SY8291ABC; Device: SY8291ABC; LCSC Part Name: 降压型; Supplier Part: C125896; Manufacturer Part: SY8291ABC; Supplier Footprint: SOT-23-6; JLCPCB Part Class: Extended Part; Datasheet: https://atta.szlcsc.com/upload/public/pdf/source/20170810/C125896_1502335372633879954.pdf; Supplier: LCSC; Convert to PCB: yes; Synchronous Rectification: -; Number of Outputs: -; Topology: -; Input Voltage: -; Output Current (Max): -; Switching Frequency: -
U3 = ME6211C33R5G: Manufacturer: MICRONE(南京微盟); Add into BOM: yes; Name: ME6211C33R5G; Symbol: ME6211C33R5G; Device: ME6211C33R5G; LCSC Part Name: High Speed LDO Regulators, High PSRR, Low noise; Supplier Part: C235316; Manufacturer Part: ME6211C33R5G; Supplier Footprint: SOT-353; JLCPCB Part Class: Extended Part; Datasheet: https://atta.szlcsc.com/upload/public/pdf/source/20180719/C235316_A35490DF9B0686070E5536ED6E1BEA47.pdf; Supplier: LCSC; Convert to PCB: yes
U9 = SP3485EEN: Manufacturer: UMW(广东友台半导体); Add into BOM: yes; Name: SP3485EEN; Symbol: SP3485EEN; Device: SP3485EEN; LCSC Part Name: SP3485EEN; Supplier Part: C668205; Manufacturer Part: SP3485EEN; Supplier Footprint: SOP-8; JLCPCB Part Class: Extended Part; Datasheet: https://atta.szlcsc.com/upload/public/pdf/source/20221009/2FEF7A2E83435CC21653A42B67D28760.pdf; Supplier: LCSC; Convert to PCB: yes
U10 = CD74HC154M96: Manufacturer: TI(德州仪器); Add into BOM: yes; Current-OutputLow: 5.2mA; Voltage Supply Source: 单电源; Supply Voltage: 2V~6V; Name: CD74HC154M96; Symbol: CD74HC154M96; Device: CD74HC154M96; LCSC Part Name: 解码器/多路解器 单电源 2V~6V; Supplier Part: C2832236; Manufacturer Part: CD74HC154M96; Supplier Footprint: SOIC-24; JLCPCB Part Class: Extended Part; Supplier: LCSC; Convert to PCB: yes; Type: 解码器/多路解器; Current-OutputHigh: 5.2mA; Operating temperature: -55℃~+125℃
U11 = AGM402A1: Manufacturer: AGM-Semi(芯控源); Add into BOM: yes; Drain Source Voltage (Vdss): 40V; Continuous Drain Current (Id): 140A; Power Dissipation (Pd): 125W; Drain Source On Resistance (RDS(on)@Vgs,Id): 2.3mΩ@10V,40A; Gate Threshold Voltage (Vgs(th)@Id): 2.5V@250uA; Total Gate Charge (Qg@Vgs): 73nC@10V; Name: AGM402A1; Symbol: AGM402A1; Device: AGM402A1; LCSC Part Name: N沟道 40V 140A; Supplier Part: C5184862; Manufacturer Part: AGM402A1; Supplier Footprint: DFN5x6; Datasheet: https://atta.szlcsc.com/upload/public/pdf/source/20220929/F21636FBD51A924824315CBABD8C2ADF.pdf; Supplier: LCSC; Convert to PCB: yes; Type: N沟道; Operating Temperature: -55℃~+150℃@(Tj)
X1 = XTAL-4P: 4脚无源晶振; 淘宝ID: 小糖豆的小窝窝; BOM名称: 4脚无源晶振; 下单链接: https://item.taobao.com/item.htm?ft=t&id=613637044352